# Altium schematic sheet 12V_9V_Power_Stage.SchDoc (part 2 of 4)
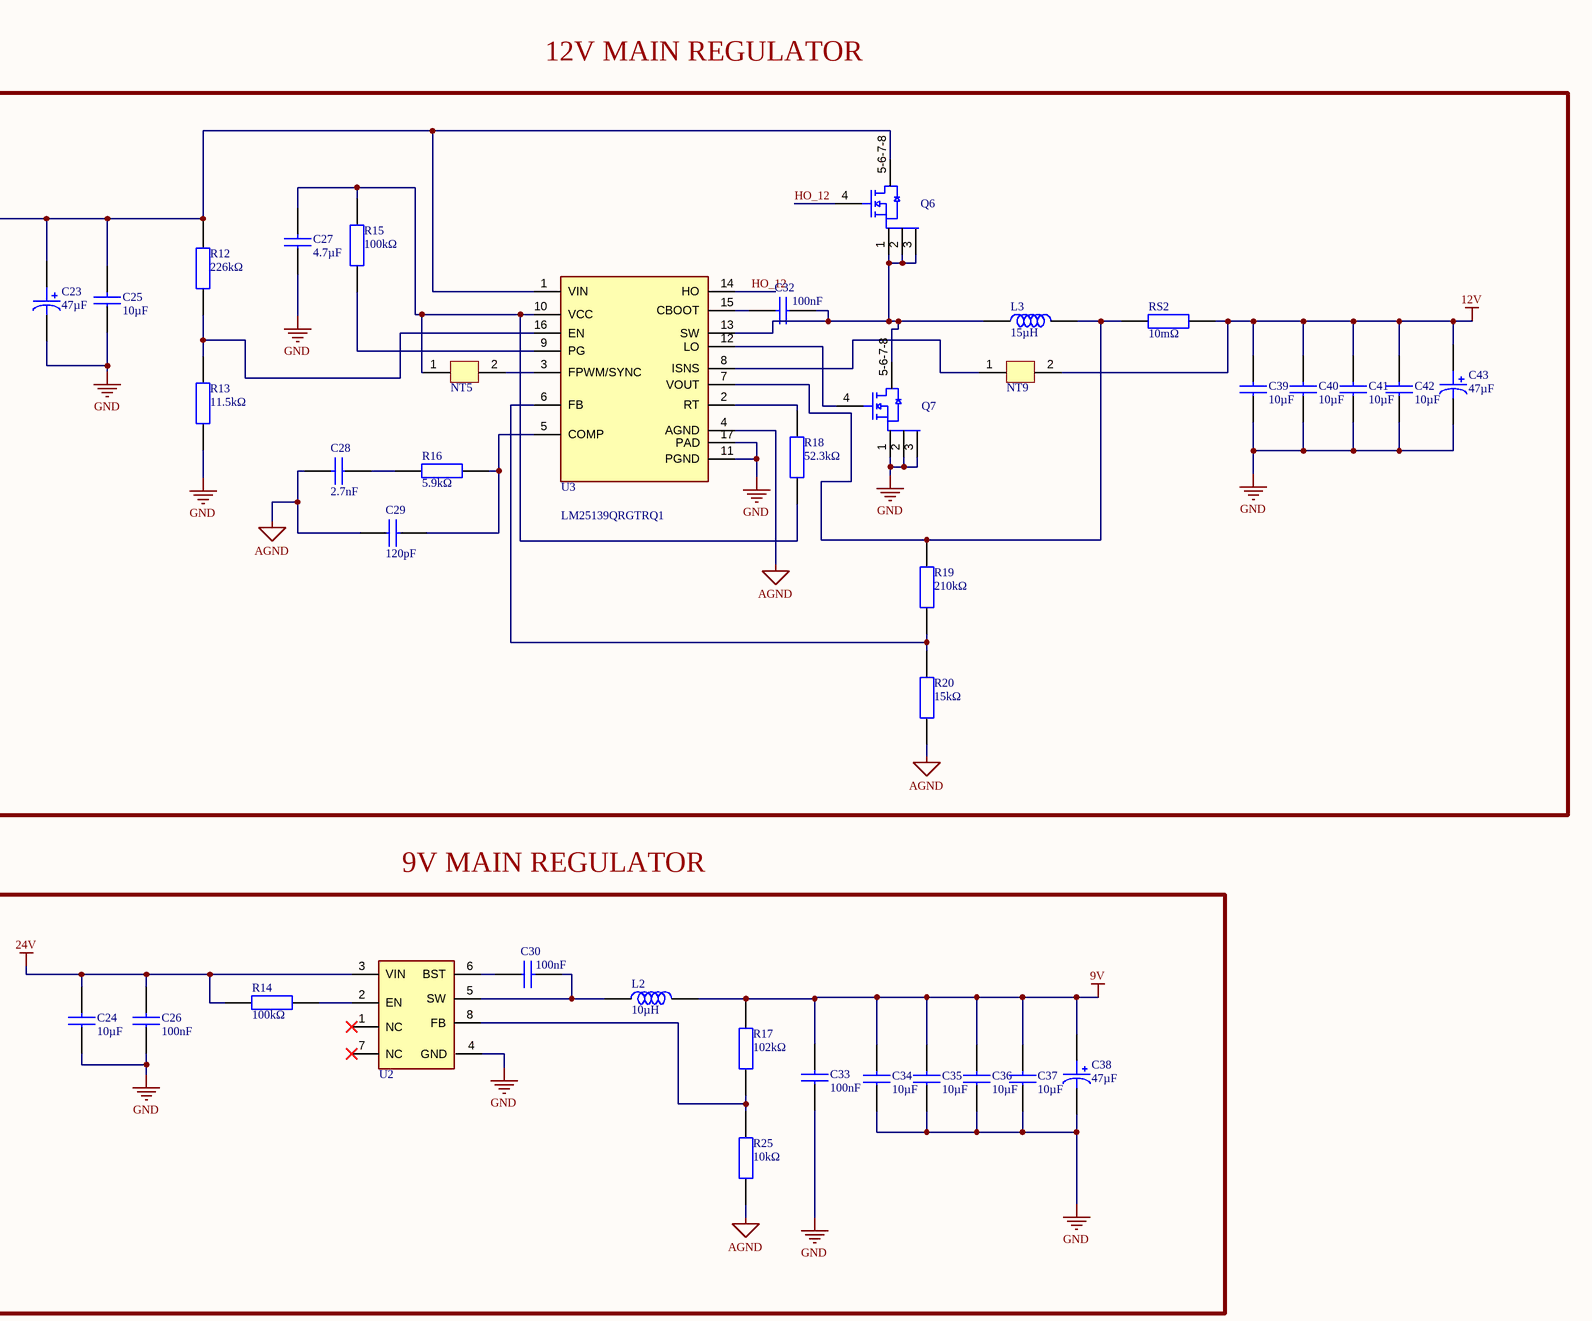
[diagram p2: 12V_9V_Power_Stage.SchDoc, right]

## Library data of the parts (continued)
C34-C37 C39-C42 = GRM31CR71E106KA12L: 25V 10uF X7R ±10% 1206 Multilayer Ceramic Capacitors MLCC - SMD/SMT ROHS; Manufacturer: Murata; Manufacturer Lifecycle Status: IN PRODUCTION; Supplier: Farnell; Supplier Part Number: GRM31CR71E106KA12L; Manufacturer Part Number: GRM31CR71E106KA12L; RoHS: Compliant; Category: Ceramic Capacitors; Stock: 33950; Pricing: 5=0,287, 50=0,122, 250=0,109, 500=0,085, 1000=0,0755 (EUR); Case/Package: 1206; Case Code (Imperial): 1206; Case Code (Metric): 3216; China RoHS: Compliant; Depth: 1.6mm; Dielectric: X7R; Dielectric Material: Ceramic; Height: 1.6mm; Lead Free: Lead Free; Length: 3.2mm; Lifecycle Status: Production; Material: Ceramic; Max Operating Temperature: 125°C; Min Operating Temperature: -55°C; Mounting Technology: Surface Mount; Pins: 2; Number of Terminals: 2; Packaging: Cut Tape; Radiation Hardening: No; REACH SVHC: Yes; Schedule B: 8532240020, 8532240020|8532240020, 8532240020|8532240020|8532240020, 8532240020|8532240020|8532240020|8532240020; Termination: SMD/SMT; Thickness: 1.6mm; Tolerance: 10%; Voltage: 25V; Voltage Rating: 25V; Voltage Rating (DC): 25V; Width: 1.6mm; ComponentLink1URL: https://datasheet.octopart.com:443/GRM31CR71E106KA12L-Murata-datasheet-32479577.pdf?src-supplier=Upverter; ComponentLink1Description: https://datasheet.octopart.com:443/GRM31CR71E106KA12L-Murata-datasheet-32479577.pdf?src-supplier=Upverter; ComponentLink2URL: https://datasheet.octopart.com:443/GRM31CR71E106KA12L-Murata-datasheet-62320264.pdf?src-supplier=Farnell; ComponentLink2Description: https://datasheet.octopart.com:443/GRM31CR71E106KA12L-Murata-datasheet-62320264.pdf?src-supplier=Farnell; ComponentLink3URL: https://datasheet.octopart.com:443/GRM31CR71E106KA12L-Murata-datasheet-7550257.pdf?src-supplier=Farnell; ComponentLink3Description: https://datasheet.octopart.com:443/GRM31CR71E106KA12L-Murata-datasheet-7550257.pdf?src-supplier=Farnell; ComponentLink4URL: https://datasheet.octopart.com:443/GRM31CR71E106KA12L-Murata-datasheet-8817987.pdf?src-supplier=Newark; ComponentLink4Description: https://datasheet.octopart.com:443/GRM31CR71E106KA12L-Murata-datasheet-8817987.pdf?src-supplier=Newark; ComponentLink5URL: https://datasheet.octopart.com:443/GRM31CR71E106KA12L-Murata-datasheet-8085059.pdf?src-supplier=element14+APAC; ComponentLink5Description: https://datasheet.octopart.com:443/GRM31CR71E106KA12L-Murata-datasheet-8085059.pdf?src-supplier=element14+APAC; ComponentLink6URL: https://datasheet.octopart.com:443/GRM31CR71E106KA12L-Murata-datasheet-17853182.pdf?src-supplier=element14+APAC; ComponentLink6Description: https://datasheet.octopart.com:443/GRM31CR71E106KA12L-Murata-datasheet-17853182.pdf?src-supplier=element14+APAC; ComponentLink7URL: https://datasheet.octopart.com:443/GRM31CR71E106KA12L-Murata-datasheet-14397761.pdf?src-supplier=Future+Electronics; ComponentLink7Description: https://datasheet.octopart.com:443/GRM31CR71E106KA12L-Murata-datasheet-14397761.pdf?src-supplier=Future+Electronics; ComponentLink8URL: https://datasheet.octopart.com:443/GRM31CR71E106KA12L-Murata-datasheet-22122223.pdf?src-supplier=Future+Electronics; ComponentLink8Description: https://datasheet.octopart.com:443/GRM31CR71E106KA12L-Murata-datasheet-22122223.pdf?src-supplier=Future+Electronics; ComponentLink9URL: https://datasheet.octopart.com:443/GRM31CR71E106KA12L-Murata-datasheet-12536416.pdf?src-supplier=Future+Electronics; ComponentLink9Description: https://datasheet.octopart.com:443/GRM31CR71E106KA12L-Murata-datasheet-12536416.pdf?src-supplier=Future+Electronics; ComponentLink10URL: https://datasheet.octopart.com:443/GRM31CR71E106KA12L-Murata-datasheet-38883574.pdf?src-supplier=Future+Electronics; ComponentLink10Description: https://datasheet.octopart.com:443/GRM31CR71E106KA12L-Murata-datasheet-38883574.pdf?src-supplier=Future+Electronics; ComponentLink11URL: https://datasheet.octopart.com:443/GRM31CR71E106KA12L-Murata-datasheet-165579666.pdf?src-supplier=TME; ComponentLink11Description: https://datasheet.octopart.com:443/GRM31CR71E106KA12L-Murata-datasheet-165579666.pdf?src-supplier=TME; ComponentLink12URL: https://datasheet.octopart.com:443/GRM31CR71E106KA12L-Murata-datasheet-59876780.pdf?src-supplier=TME; ComponentLink12Description: https://datasheet.octopart.com:443/GRM31CR71E106KA12L-Murata-datasheet-59876780.pdf?src-supplier=TME; ComponentLink13URL: https://datasheet.octopart.com:443/GRM31CR71E106KA12L-Murata-datasheet-140709144.pdf?src-supplier=Ciiva; ComponentLink13Description: https://datasheet.octopart.com:443/GRM31CR71E106KA12L-Murata-datasheet-140709144.pdf?src-supplier=Ciiva; ComponentLink14URL: https://datasheet.octopart.com:443/GRM31CR71E106KA12L-Murata-datasheet-138746391.pdf?src-supplier=Ciiva; ComponentLink14Description: https://datasheet.octopart.com:443/GRM31CR71E106KA12L-Murata-datasheet-138746391.pdf?src-supplier=Ciiva; ComponentLink15URL: https://datasheet.octopart.com:443/GRM31CR71E106KA12L-Murata-datasheet-102370999.pdf?src-supplier=HQonline; ComponentLink15Description: https://datasheet.octopart.com:443/GRM31CR71E106KA12L-Murata-datasheet-102370999.pdf?src-supplier=HQonline; ComponentLink16URL: https://datasheet.octopart.com/GRM31CR71E106KA12L-Murata-datasheet-12515295.pdf; ComponentLink16Description: https://datasheet.octopart.com/GRM31CR71E106KA12L-Murata-datasheet-12515295.pdf; ComponentLink17URL: https://datasheet.octopart.com/GRM31CR71E106KA12L-Murata-datasheet-12510076.pdf; ComponentLink17Description: https://datasheet.octopart.com/GRM31CR71E106KA12L-Murata-datasheet-12510076.pdf; ComponentLink18URL: https://datasheet.octopart.com/GRM31CR71E106KA12L-Murata-datasheet-11978611.pdf; ComponentLink18Description: https://datasheet.octopart.com/GRM31CR71E106KA12L-Murata-datasheet-11978611.pdf; ComponentLink19URL: https://datasheet.octopart.com/GRM31CR71E106KA12L-Murata-datasheet-10025737.pdf; ComponentLink19Description: https://datasheet.octopart.com/GRM31CR71E106KA12L-Murata-datasheet-10025737.pdf; ComponentLink20URL: https://datasheet.octopart.com/GRM31CR71E106KA12L-Murata-datasheet-8819587.pdf; ComponentLink20Description: https://datasheet.octopart.com/GRM31CR71E106KA12L-Murata-datasheet-8819587.pdf; ComponentLink21URL: https://datasheet.octopart.com:443/GRM31CR71E106KA12L-Murata-datasheet-151453090.pdf?src-supplier=Arrow.cn; ComponentLink21Description: https://datasheet.octopart.com:443/GRM31CR71E106KA12L-Murata-datasheet-151453090.pdf?src-supplier=Arrow.cn; ComponentLink22URL: http://sigma.octopart.com:80/reach_statement/Murata-company-16.pdf?src-supplier=Compliance+Statements; ComponentLink22Description: http://sigma.octopart.com:80/reach_statement/Murata-company-16.pdf?src-supplier=Compliance+Statements
L2 = SRR1208-100ML: Inductor Power Shielded Wirewound 10uH 20% 1KHz 20Q-Factor Ferrite 5A 0.021Ohm DCR T/R; Manufacturer: Bourns; DC Resistance (DCR): 21mΩ; Frequency: 15MHz; Material: Steel; Number of Circuits: 1; Q Factor: 20; Saturation Current: 6.7A; Supplier: Farnell; Supplier Part Number: SRR1208-100ML; Manufacturer Part Number: SRR1208-100ML; RoHS: Compliant; Category: Fixed Inductors; Stock: 4863; Pricing: 1=0,771, 10=0,653, 50=0,619, 100=0,551, 200=0,54 (EUR); Case/Package: 5050; China RoHS: Compliant; Composition: Wirewound; Core Material: Ferrite; Country of Origin: Mainland China; Current Rating: 5A; DC Current: 5A; Depth: 13mm; Export Control Classification Number (ECCN) Code: EAR99; Height: 8.5mm; Height - Seated (Max): 8.509mm; Harmonized Tariff Schedule (HTS) Code: 8504.50.80.00; Inductance Tolerance: 20%; Introduction Date: 2004-11-10; Length: 12.7mm; Lifecycle Status: Production; Max Current Rating: 5A; Max DC Current: 5A; Max Operating Temperature: 125°C; Military Standard: Not; Min Operating Temperature: -40°C; Mounting Technology: Surface Mount; Pins: 2; Number of Terminals: 2; REACH SVHC: Yes; Schedule B: 8504500000, 8504500000|8504500000, 8504500000|8504500000|8504500000, 8504500000|8504500000|8504500000|8504500000; Self Resonant Frequency: 15MHz; Shielding: Shielded; Termination: SMD/SMT; Test Frequency: 1kHz; Tolerance: 20%; Width: 12.7mm; ComponentLink1URL: https://datasheet.octopart.com:443/SRR1208-100ML-Bourns-datasheet-154729978.pdf?src-supplier=Newark; ComponentLink1Description: https://datasheet.octopart.com:443/SRR1208-100ML-Bourns-datasheet-154729978.pdf?src-supplier=Newark; ComponentLink2URL: https://datasheet.octopart.com:443/SRR1208-100ML-Bourns-datasheet-68307255.pdf?src-supplier=Newark; ComponentLink2Description: https://datasheet.octopart.com:443/SRR1208-100ML-Bourns-datasheet-68307255.pdf?src-supplier=Newark; ComponentLink3URL: https://datasheet.octopart.com:443/SRR1208-100ML-Bourns-datasheet-99355712.pdf?src-supplier=Newark; ComponentLink3Description: https://datasheet.octopart.com:443/SRR1208-100ML-Bourns-datasheet-99355712.pdf?src-supplier=Newark; ComponentLink4URL: https://datasheet.octopart.com:443/SRR1208-100ML-Bourns-datasheet-5459063.pdf?src-supplier=Newark; ComponentLink4Description: https://datasheet.octopart.com:443/SRR1208-100ML-Bourns-datasheet-5459063.pdf?src-supplier=Newark; ComponentLink5URL: https://datasheet.octopart.com:443/SRR1208-100ML-Bourns-datasheet-11548354.pdf?src-supplier=Farnell; ComponentLink5Description: https://datasheet.octopart.com:443/SRR1208-100ML-Bourns-datasheet-11548354.pdf?src-supplier=Farnell; ComponentLink6URL: https://datasheet.octopart.com:443/SRR1208-100ML-Bourns-datasheet-62333742.pdf?src-supplier=Farnell; ComponentLink6Description: https://datasheet.octopart.com:443/SRR1208-100ML-Bourns-datasheet-62333742.pdf?src-supplier=Farnell; ComponentLink7URL: https://datasheet.octopart.com:443/SRR1208-100ML-Bourns-datasheet-41338362.pdf?src-supplier=RS+(Formerly+Allied+Electronics); ComponentLink7Description: https://datasheet.octopart.com:443/SRR1208-100ML-Bourns-datasheet-41338362.pdf?src-supplier=RS+(Formerly+Allied+Electronics); ComponentLink8URL: https://datasheet.octopart.com:443/SRR1208-100ML-Bourns-datasheet-37486976.pdf?src-supplier=RS+(Formerly+Allied+Electronics); ComponentLink8Description: https://datasheet.octopart.com:443/SRR1208-100ML-Bourns-datasheet-37486976.pdf?src-supplier=RS+(Formerly+Allied+Electronics); ComponentLink9URL: https://datasheet.octopart.com:443/SRR1208-100ML-Bourns-datasheet-56155.pdf?src-supplier=RS+(Formerly+Allied+Electronics); ComponentLink9Description: https://datasheet.octopart.com:443/SRR1208-100ML-Bourns-datasheet-56155.pdf?src-supplier=RS+(Formerly+Allied+Electronics); ComponentLink10URL: http://sigma.octopart.com:80/conflict_mineral_statement/Bourns-company-36.pdf?src-supplier=Compliance+Statements; ComponentLink10Description: http://sigma.octopart.com:80/conflict_mineral_statement/Bourns-company-36.pdf?src-supplier=Compliance+Statements
L3 = MSS1210-153MED: General Purpose Inductor, 15uH, 20%, 1 Element, Ferrite-Core, SMD, 4848, CHIP, 4747; Manufacturer: Coilcraft; DC Resistance (DCR): 22mΩ; Max Current Rating: 5.7A; Max DC Current: 8.7A; Number of Circuits: 1; Saturation Current: 8.3A; Self Resonant Frequency: 12MHz; Shielding: Shielded; Test Frequency: 100kHz; Supplier: Farnell; Supplier Part Number: MSS1210-153MED; Manufacturer Part Number: MSS1210-153MED; RoHS: Compliant; Category: Fixed Inductors; Stock: 1322; Pricing: 1=4,65, 10=4,42, 25=4,19, 50=3,96, 100=3,11, 300=2,49 (EUR); Case/Package: SMD/SMT; Core Material: Ferrite; Height: 10mm; Inductance Tolerance: 20%; Lead Free: Contains Lead; Length: 12mm; Lifecycle Status: Production; Max Operating Temperature: 85°C; Min Operating Temperature: -40°C; Mounting Technology: Surface Mount; Number of Terminals: 2; Packaging: Cut Tape; Ratings: AEC-Q200; REACH SVHC: Yes; RMS Current (Irms): 8.7A; Termination: SMD/SMT; Tolerance: 20%; Width: 12mm; ComponentLink1URL: https://datasheet.octopart.com:443/MSS1210-153MED-Coilcraft-datasheet-180119303.pdf?src-supplier=IHS; ComponentLink1Description: https://datasheet.octopart.com:443/MSS1210-153MED-Coilcraft-datasheet-180119303.pdf?src-supplier=IHS; ComponentLink2URL: https://datasheet.octopart.com:443/MSS1210-153MED-Coilcraft-datasheet-14354322.pdf?src-supplier=Newark; ComponentLink2Description: https://datasheet.octopart.com:443/MSS1210-153MED-Coilcraft-datasheet-14354322.pdf?src-supplier=Newark; ComponentLink3URL: https://datasheet.octopart.com:443/MSS1210-153MED-Coilcraft-datasheet-17369939.pdf?src-supplier=Coilcraft+Direct; ComponentLink3Description: https://datasheet.octopart.com:443/MSS1210-153MED-Coilcraft-datasheet-17369939.pdf?src-supplier=Coilcraft+Direct
Q6 Q7 = CSD18540Q5B: 60-V, N channel NexFET™ power MOSFET, single SON 5 mm x 6 mm, 2.2 mOhm 8-VSON-CLIP -55 to 175; Manufacturer: Texas Instruments; Manufacturer Lifecycle Status: ACTIVE; Continuous Drain Current (ID): 29A; Drain to Source Resistance: 1.8mΩ; Drain to Source Voltage (Vdss): 60V; Fall Time: 3ns; Gate to Source Voltage (Vgs): 20V; Input Capacitance: 4.23nF; Max Junction Temperature (Tj): 175°C; Max Power Dissipation: 3.1W; Number of Channels: 1; Power Dissipation: 3.8W; Rds On Max: 2.2mΩ; Rise Time: 9ns; Turn-Off Delay Time: 20ns; Turn-On Delay Time: 6ns; Supplier: Arrow Electronics; Supplier Part Number: CSD18540Q5B; Manufacturer Part Number: CSD18540Q5B; RoHS: Compliant; Category: MOSFETs; Stock: 867; Pricing: 1=2,6866, 10=1,8382, 25=1,8215, 100=1,293, 250=1,2821, 500=1,0204 (USD); Contact Plating: Gold; Element Configuration: Single; Height: 0m; Lead Free: Contains Lead; Length: 5mm; Lifecycle Status: Production; Max Operating Temperature: 175°C; Min Operating Temperature: -55°C; Mounting Technology: Surface Mount; Pins: 8; Packaging: Tape & Reel (TR); Schedule B: 8541290080, 8541290080|8541290080|8541290080|8541290080|8541290080; Thickness: 950µm; Width: 5mm; ComponentLink1URL: https://datasheet.octopart.com:443/CSD18540Q5B-Texas-Instruments-datasheet-41215267.pdf?src-supplier=Texas+Instruments; ComponentLink1Description: https://datasheet.octopart.com:443/CSD18540Q5B-Texas-Instruments-datasheet-41215267.pdf?src-supplier=Texas+Instruments; ComponentLink2URL: https://octopart.com:443/opatz8j6/c1?t=SUskelIlBWIo_nWBJiAx1_ldGWU3oeiOn-EJs-5do1YusiS-JDvlKRrouVl-Y20ao-5z_08mEvz_AeJefeF_pOrLs0WfjhDJ2_xgnnOXWDpra4Cd3mKzckoQ6QanCMAXyB-vVCGNjBMeeyDAJ_8AtgWzG5J-VV0M2AC15IA14uOxBYYbIO1uRZi3YsibPr8OpLgj2-g8ey3MShCBBxtcPxAJXU9zClIpSD2jte82BFzbVJ9hhAzdJsrLZ3RNwxiUfmRI5v2vfH2Xq2tWnkVJNmbpw4R6VYt-2jb8TG9SzpqJvWz5ux_mibd2tkPbQSuE4I96mnLqjONPYMf24_myiaENOmBZXsZhO5Lu3rDJDhrEeNYScROBq6ZJRXBJXpuxfZxAZ_Uv9q79&src-supplier=Texas+Instruments; ComponentLink2Description: https://octopart.com:443/opatz8j6/c1?t=SUskelIlBWIo_nWBJiAx1_ldGWU3oeiOn-EJs-5do1YusiS-JDvlKRrouVl-Y20ao-5z_08mEvz_AeJefeF_pOrLs0WfjhDJ2_xgnnOXWDpra4Cd3mKzckoQ6QanCMAXyB-vVCGNjBMeeyDAJ_8AtgWzG5J-VV0M2AC15IA14uOxBYYbIO1uRZi3YsibPr8OpLgj2-g8ey3MShCBBxtcPxAJXU9zClIpSD2jte82BFzbVJ9hhAzdJsrLZ3RNwxiUfmRI5v2vfH2Xq2tWnkVJNmbpw4R6VYt-2jb8TG9SzpqJvWz5ux_mibd2tkPbQSuE4I96mnLqjONPYMf24_myiaENOmBZXsZhO5Lu3rDJDhrEeNYScROBq6ZJRXBJXpuxfZxAZ_Uv9q79&src-supplier=Texas+Instruments; ComponentLink3URL: https://datasheet.octopart.com:443/CSD18540Q5B-Texas-Instruments-datasheet-27303987.pdf?src-supplier=Texas+Instruments; ComponentLink3Description: https://datasheet.octopart.com:443/CSD18540Q5B-Texas-Instruments-datasheet-27303987.pdf?src-supplier=Texas+Instruments; ComponentLink4URL: https://datasheet.octopart.com:443/CSD18540Q5B-Texas-Instruments-datasheet-145028107.pdf?src-supplier=Arrow.cn; ComponentLink4Description: https://datasheet.octopart.com:443/CSD18540Q5B-Texas-Instruments-datasheet-145028107.pdf?src-supplier=Arrow.cn; ComponentLink5URL: http://sigma.octopart.com:80/reach_statement/Texas-Instruments-company-64.pdf?src-supplier=Compliance+Statements; ComponentLink5Description: http://sigma.octopart.com:80/reach_statement/Texas-Instruments-company-64.pdf?src-supplier=Compliance+Statements; ComponentLink6URL: http://sigma.octopart.com:80/conflict_mineral_statement/Texas-Instruments-company-63.pdf?src-supplier=Compliance+Statements; ComponentLink6Description: http://sigma.octopart.com:80/conflict_mineral_statement/Texas-Instruments-company-63.pdf?src-supplier=Compliance+Statements
R12 = CRCW0402226KFKED: Fixed Resistor, Metal Glaze/Thick Film, 0.063W, 226000ohm, 50V, 1% +/-Tol, Surface Mount, 0402; Manufacturer: Vishay; Max Power Dissipation: 63mW; Temperature Coefficient: 100ppm/°C; Supplier: Future Electronics; Supplier Part Number: CRCW0402226KFKED; Manufacturer Part Number: CRCW0402226KFKED; RoHS: Compliant; Category: Chip SMD Resistors; Stock: 20000; Pricing: 20000=0,0012, 100000=0,0011, 250000=0,0011, 750000=0,0011, 1500000=0,001 (USD); Case/Package: 0402; Case Code (Imperial): 0402; China RoHS: Non-Compliant; Composition: Thick Film; Contact Plating: Tin; Country of Origin: Israel, Taiwan; Depth: 500µm; Export Control Classification Number (ECCN) Code: EAR99; Features: Automotive AEC-Q200; Height: 350µm; Harmonized Tariff Schedule (HTS) Code: 8533.21.00.30; Introduction Date: 2005-03-24; Lead Free: Lead Free; Length: 1mm; Lifecycle Status: Production; Max Operating Temperature: 155°C; Military Standard: Not; Min Operating Temperature: -55°C; Mounting Technology: Surface Mount; Pins: 2; Number of Terminals: 2; Number of Terminations: 2; Packaging: Cut Tape; Power Rating: 63mW; Ratings: AEC-Q200; REACH SVHC: Yes; Termination: SMD/SMT; Tolerance: 1%; Voltage Rating: 50V; Voltage Rating (DC): 50V; Weight: 652.039032µg; Width: 500µm; Working Voltage: 50V; ComponentLink1URL: https://datasheet.octopart.com:443/CRCW0402226KFKED-Vishay-datasheet-175423584.pdf?src-supplier=IHS; ComponentLink1Description: https://datasheet.octopart.com:443/CRCW0402226KFKED-Vishay-datasheet-175423584.pdf?src-supplier=IHS; ComponentLink2URL: https://datasheet.octopart.com:443/CRCW0402226KFKED-Vishay-datasheet-66077789.pdf?src-supplier=Newark; ComponentLink2Description: https://datasheet.octopart.com:443/CRCW0402226KFKED-Vishay-datasheet-66077789.pdf?src-supplier=Newark; ComponentLink3URL: https://datasheet.octopart.com:443/CRCW0402226KFKED-Vishay-datasheet-11761042.pdf?src-supplier=Newark; ComponentLink3Description: https://datasheet.octopart.com:443/CRCW0402226KFKED-Vishay-datasheet-11761042.pdf?src-supplier=Newark; ComponentLink4URL: https://datasheet.octopart.com:443/CRCW0402226KFKED-Vishay-datasheet-11516975.pdf?src-supplier=Newark; ComponentLink4Description: https://datasheet.octopart.com:443/CRCW0402226KFKED-Vishay-datasheet-11516975.pdf?src-supplier=Newark; ComponentLink5URL: https://datasheet.octopart.com:443/CRCW0402226KFKED-Vishay-datasheet-159614168.pdf?src-supplier=Newark; ComponentLink5Description: https://datasheet.octopart.com:443/CRCW0402226KFKED-Vishay-datasheet-159614168.pdf?src-supplier=Newark; ComponentLink6URL: https://datasheet.octopart.com:443/CRCW0402226KFKED-Vishay-datasheet-33013972.pdf?src-supplier=Newark; ComponentLink6Description: https://datasheet.octopart.com:443/CRCW0402226KFKED-Vishay-datasheet-33013972.pdf?src-supplier=Newark; ComponentLink7URL: https://datasheet.octopart.com:443/CRCW0402226KFKED-Vishay-datasheet-21268114.pdf?src-supplier=Newark; ComponentLink7Description: https://datasheet.octopart.com:443/CRCW0402226KFKED-Vishay-datasheet-21268114.pdf?src-supplier=Newark; ComponentLink8URL: https://datasheet.octopart.com:443/CRCW0402226KFKED-Vishay-datasheet-21226360.pdf?src-supplier=Newark; ComponentLink8Description: https://datasheet.octopart.com:443/CRCW0402226KFKED-Vishay-datasheet-21226360.pdf?src-supplier=Newark; ComponentLink9URL: https://datasheet.octopart.com:443/CRCW0402226KFKED-Vishay-datasheet-62317933.pdf?src-supplier=element14+APAC; ComponentLink9Description: https://datasheet.octopart.com:443/CRCW0402226KFKED-Vishay-datasheet-62317933.pdf?src-supplier=element14+APAC; ComponentLink10URL: https://datasheet.octopart.com:443/CRCW0402226KFKED.-Vishay-datasheet-83961561.pdf?src-supplier=element14+APAC; ComponentLink10Description: https://datasheet.octopart.com:443/CRCW0402226KFKED.-Vishay-datasheet-83961561.pdf?src-supplier=element14+APAC; ComponentLink11URL: https://datasheet.octopart.com:443/CRCW0402226KFKED-Vishay-datasheet-14722531.pdf?src-supplier=element14+APAC; ComponentLink11Description: https://datasheet.octopart.com:443/CRCW0402226KFKED-Vishay-datasheet-14722531.pdf?src-supplier=element14+APAC; ComponentLink12URL: https://datasheet.octopart.com:443/CRCW0402226KFKED-Vishay-datasheet-5299586.pdf?src-supplier=element14+APAC; ComponentLink12Description: https://datasheet.octopart.com:443/CRCW0402226KFKED-Vishay-datasheet-5299586.pdf?src-supplier=element14+APAC; ComponentLink13URL: https://datasheet.octopart.com:443/CRCW0402226KFKED-Vishay-datasheet-10380026.pdf?src-supplier=element14+APAC; ComponentLink13Description: https://datasheet.octopart.com:443/CRCW0402226KFKED-Vishay-datasheet-10380026.pdf?src-supplier=element14+APAC; ComponentLink14URL: https://datasheet.octopart.com:443/CRCW0402226KFKED-Vishay-datasheet-62316122.pdf?src-supplier=Future+Electronics; ComponentLink14Description: https://datasheet.octopart.com:443/CRCW0402226KFKED-Vishay-datasheet-62316122.pdf?src-supplier=Future+Electronics; ComponentLink15URL: https://datasheet.octopart.com:443/CRCW0402226KFKED-Vishay-datasheet-12509741.pdf?src-supplier=Future+Electronics; ComponentLink15Description: https://datasheet.octopart.com:443/CRCW0402226KFKED-Vishay-datasheet-12509741.pdf?src-supplier=Future+Electronics; ComponentLink16URL: https://datasheet.octopart.com/D-CRCW-e3-Standard-Thick-Film-Chip-Resistors-Vishay-datasheet-family-64.pdf; ComponentLink16Description: https://datasheet.octopart.com/D-CRCW-e3-Standard-Thick-Film-Chip-Resistors-Vishay-datasheet-family-64.pdf; ComponentLink17URL: https://datasheet.octopart.com:443/CRCW0402226KFKED-Vishay-datasheet-8445837.pdf?src-supplier=element14; ComponentLink17Description: https://datasheet.octopart.com:443/CRCW0402226KFKED-Vishay-datasheet-8445837.pdf?src-supplier=element14; ComponentLink18URL: https://datasheet.octopart.com:443/CRCW0402226KFKED-Vishay-datasheet-5377255.pdf?src-supplier=Garrett; ComponentLink18Description: https://datasheet.octopart.com:443/CRCW0402226KFKED-Vishay-datasheet-5377255.pdf?src-supplier=Garrett; ComponentLink19URL: https://datasheet.octopart.com:443/CRCW0402226KFKED-Vishay-datasheet-148188.pdf?src-supplier=Garrett; ComponentLink19Description: https://datasheet.octopart.com:443/CRCW0402226KFKED-Vishay-datasheet-148188.pdf?src-supplier=Garrett; ComponentLink20URL: https://datasheet.octopart.com:443/CRCW0402226KFKED-Vishay-datasheet-42367.pdf?src-supplier=Garrett; ComponentLink20Description: https://datasheet.octopart.com:443/CRCW0402226KFKED-Vishay-datasheet-42367.pdf?src-supplier=Garrett; ComponentLink21URL: http://sigma.octopart.com:80/rohs_certificate/D-CRCW-e3-Standard-Thick-Film-Chip-Resistors-Vishay-family-102.pdf?src-supplier=Compliance+Statements; ComponentLink21Description: http://sigma.octopart.com:80/rohs_certificate/D-CRCW-e3-Standard-Thick-Film-Chip-Resistors-Vishay-family-102.pdf?src-supplier=Compliance+Statements
R13 = CRCW040211K5FKED: Res Thick Film 0402 11.5K Ohm 1% 1/16W ±100ppm/°C Molded SMD SMD Paper T/R; Manufacturer: Vishay; Max Power Dissipation: 63mW; Voltage Rating: 50V; Supplier: Farnell; Supplier Part Number: CRCW040211K5FKED; Manufacturer Part Number: CRCW040211K5FKED; RoHS: Compliant; Category: Chip SMD Resistors; Stock: 19624; Pricing: 10000=0,0092 (EUR); Case/Package: 0402; Case Code (Imperial): 0402; China RoHS: Non-Compliant; Composition: Thick Film; Contact Plating: Tin; Country of Origin: Israel, Taiwan; Depth: 500µm; Export Control Classification Number (ECCN) Code: EAR99; Features: Automotive AEC-Q200; Height: 350µm; Harmonized Tariff Schedule (HTS) Code: 8533.21.00.30; Introduction Date: 2005-03-24; Lead Free: Lead Free; Length: 1mm; Lifecycle Status: Production; Max Operating Temperature: 155°C; Military Standard: Not; Min Operating Temperature: -55°C; Mounting Technology: Surface Mount; Pins: 2; Number of Terminals: 2; Number of Terminations: 2; Packaging: Cut Tape; Power Rating: 63mW; Radiation Hardening: No; Ratings: AEC-Q200; REACH SVHC: Yes; Schedule B: 8533210045, 8533210045|8533210045, 8533210045|8533210045|8533210045, 8533210045|8533210045|8533210045|8533210045; Temperature Coefficient: 100ppm/°C; Termination: SMD/SMT; Tolerance: 1%; Voltage Rating (DC): 50V; Weight: 652.039032µg; Width: 500µm; Working Voltage: 50V; ComponentLink1URL: https://datasheet.octopart.com:443/CRCW040211K5FKED-Vishay-datasheet-175423584.pdf?src-supplier=IHS; ComponentLink1Description: https://datasheet.octopart.com:443/CRCW040211K5FKED-Vishay-datasheet-175423584.pdf?src-supplier=IHS; ComponentLink2URL: https://datasheet.octopart.com:443/CRCW040211K5FKED-Vishay-datasheet-66077789.pdf?src-supplier=Newark; ComponentLink2Description: https://datasheet.octopart.com:443/CRCW040211K5FKED-Vishay-datasheet-66077789.pdf?src-supplier=Newark; ComponentLink3URL: https://datasheet.octopart.com:443/CRCW040211K5FKED-Vishay-datasheet-11761042.pdf?src-supplier=Newark; ComponentLink3Description: https://datasheet.octopart.com:443/CRCW040211K5FKED-Vishay-datasheet-11761042.pdf?src-supplier=Newark; ComponentLink4URL: https://datasheet.octopart.com:443/CRCW040211K5FKED-Vishay-datasheet-21268114.pdf?src-supplier=Newark; ComponentLink4Description: https://datasheet.octopart.com:443/CRCW040211K5FKED-Vishay-datasheet-21268114.pdf?src-supplier=Newark; ComponentLink5URL: https://datasheet.octopart.com:443/CRCW040211K5FKED-Vishay-datasheet-21226360.pdf?src-supplier=Newark; ComponentLink5Description: https://datasheet.octopart.com:443/CRCW040211K5FKED-Vishay-datasheet-21226360.pdf?src-supplier=Newark; ComponentLink6URL: https://datasheet.octopart.com:443/CRCW040211K5FKED-Vishay-datasheet-62317936.pdf?src-supplier=Farnell; ComponentLink6Description: https://datasheet.octopart.com:443/CRCW040211K5FKED-Vishay-datasheet-62317936.pdf?src-supplier=Farnell; ComponentLink7URL: https://datasheet.octopart.com:443/CRCW040211K5FKED.-Vishay-datasheet-83961561.pdf?src-supplier=Farnell; ComponentLink7Description: https://datasheet.octopart.com:443/CRCW040211K5FKED.-Vishay-datasheet-83961561.pdf?src-supplier=Farnell; ComponentLink8URL: https://datasheet.octopart.com:443/CRCW040211K5FKED-Vishay-datasheet-11516975.pdf?src-supplier=Farnell; ComponentLink8Description: https://datasheet.octopart.com:443/CRCW040211K5FKED-Vishay-datasheet-11516975.pdf?src-supplier=Farnell; ComponentLink9URL: https://datasheet.octopart.com:443/CRCW040211K5FKED-Vishay-datasheet-33013972.pdf?src-supplier=element14+APAC; ComponentLink9Description: https://datasheet.octopart.com:443/CRCW040211K5FKED-Vishay-datasheet-33013972.pdf?src-supplier=element14+APAC; ComponentLink10URL: https://datasheet.octopart.com:443/CRCW040211K5FKED-Vishay-datasheet-14722531.pdf?src-supplier=element14+APAC; ComponentLink10Description: https://datasheet.octopart.com:443/CRCW040211K5FKED-Vishay-datasheet-14722531.pdf?src-supplier=element14+APAC; ComponentLink11URL: https://datasheet.octopart.com:443/CRCW040211K5FKED-Vishay-datasheet-137113230.pdf?src-supplier=X-ON; ComponentLink11Description: https://datasheet.octopart.com:443/CRCW040211K5FKED-Vishay-datasheet-137113230.pdf?src-supplier=X-ON; ComponentLink12URL: https://datasheet.octopart.com:443/CRCW040211K5FKED-Vishay-datasheet-62316122.pdf?src-supplier=Future+Electronics; ComponentLink12Description: https://datasheet.octopart.com:443/CRCW040211K5FKED-Vishay-datasheet-62316122.pdf?src-supplier=Future+Electronics; ComponentLink13URL: https://datasheet.octopart.com:443/CRCW040211K5FKED-Vishay-datasheet-12519820.pdf?src-supplier=Future+Electronics; ComponentLink13Description: https://datasheet.octopart.com:443/CRCW040211K5FKED-Vishay-datasheet-12519820.pdf?src-supplier=Future+Electronics; ComponentLink14URL: https://datasheet.octopart.com:443/CRCW040211K5FKED-Vishay-Dale-datasheet-47688880.pdf?src-supplier=RS+(Formerly+Allied+Electronics); ComponentLink14Description: https://datasheet.octopart.com:443/CRCW040211K5FKED-Vishay-Dale-datasheet-47688880.pdf?src-supplier=RS+(Formerly+Allied+Electronics); ComponentLink15URL: https://datasheet.octopart.com:443/CRCW040211K5FKED-Vishay-datasheet-12001583.pdf?src-supplier=RS+(Formerly+Allied+Electronics); ComponentLink15Description: https://datasheet.octopart.com:443/CRCW040211K5FKED-Vishay-datasheet-12001583.pdf?src-supplier=RS+(Formerly+Allied+Electronics); ComponentLink16URL: https://datasheet.octopart.com:443/CRCW040211K5FKED-Vishay-datasheet-5306405.pdf?src-supplier=RS+(Formerly+Allied+Electronics); ComponentLink16Description: https://datasheet.octopart.com:443/CRCW040211K5FKED-Vishay-datasheet-5306405.pdf?src-supplier=RS+(Formerly+Allied+Electronics); ComponentLink17URL: https://datasheet.octopart.com:443/CRCW040211K5FKED-Vishay-datasheet-11540273.pdf?src-supplier=Arrow+Electronics; ComponentLink17Description: https://datasheet.octopart.com:443/CRCW040211K5FKED-Vishay-datasheet-11540273.pdf?src-supplier=Arrow+Electronics; ComponentLink18URL: https://datasheet.octopart.com:443/CRCW040211K5FKED-Vishay-datasheet-8445837.pdf?src-supplier=element14; ComponentLink18Description: https://datasheet.octopart.com:443/CRCW040211K5FKED-Vishay-datasheet-8445837.pdf?src-supplier=element14; ComponentLink19URL: https://datasheet.octopart.com:443/CRCW040211K5FKED-Vishay-datasheet-5377255.pdf?src-supplier=Garrett; ComponentLink19Description: https://datasheet.octopart.com:443/CRCW040211K5FKED-Vishay-datasheet-5377255.pdf?src-supplier=Garrett; ComponentLink20URL: https://datasheet.octopart.com:443/CRCW040211K5FKED-Vishay-datasheet-148188.pdf?src-supplier=Garrett; ComponentLink20Description: https://datasheet.octopart.com:443/CRCW040211K5FKED-Vishay-datasheet-148188.pdf?src-supplier=Garrett; ComponentLink21URL: https://datasheet.octopart.com:443/CRCW040211K5FKED-Vishay-datasheet-42367.pdf?src-supplier=Garrett; ComponentLink21Description: https://datasheet.octopart.com:443/CRCW040211K5FKED-Vishay-datasheet-42367.pdf?src-supplier=Garrett; ComponentLink22URL: http://sigma.octopart.com:80/rohs_statement/Vishay-company-15.pdf?src-supplier=Compliance+Statements; ComponentLink22Description: http://sigma.octopart.com:80/rohs_statement/Vishay-company-15.pdf?src-supplier=Compliance+Statements
R14 R15 = CRCW0603100KFKEA: Res Thick Film 0603 100K Ohm 1% 1/3W ±100ppm/°C Molded SMD SMD Paper T/R; Manufacturer: Vishay; Manufacturer Part Number: CRCW0603100KFKEAHP; Max Power Dissipation: 250mW; Power Rating: 330mW; Voltage Rating: 75V; Supplier: Farnell; Supplier Part Number: CRCW0603100KFKEAHP; RoHS: Compliant; Category: Chip SMD Resistors; Stock: 78590; Pricing: 10=0,0404, 100=0,0303, 500=0,0261, 1000=0,0239, 2500=0,0223, 5000=0,0219 (EUR); Case/Package: 0603; Case Code (Imperial): 0603; Case Code (Metric): 1608; China RoHS: Non-Compliant; Composition: Thick Film; Contact Plating: Tin; Country of Origin: Israel; Depth: 850µm; Export Control Classification Number (ECCN) Code: EAR99; Features: Automotive AEC-Q200; Height: 450µm; Harmonized Tariff Schedule (HTS) Code: 8533.21.00.30; Introduction Date: 2008-07-29; Lead Free: Lead Free; Length: 1.6mm; Lifecycle Status: Production; Max Operating Temperature: 155°C; Military Standard: Not; Min Operating Temperature: -55°C; Mounting Technology: Surface Mount; Pins: 2; Number of Terminals: 2; Number of Terminations: 2; Packaging: Cut Tape; Radiation Hardening: No; Ratings: AEC-Q200; REACH SVHC: Yes; Schedule B: 8533210045, 8533210045|8533210045|8533210045|8533210045|8533210045; Temperature Coefficient: 100ppm/°C; Termination: SMD/SMT; Tolerance: 1%; Voltage Rating (DC): 75V; Weight: 2.012816mg; Width: 850µm; Working Voltage: 75V; ComponentLink1URL: https://datasheet.octopart.com:443/CRCW0603100KFKEAHP-Vishay-datasheet-13148866.pdf?src-supplier=Future+Electronics; ComponentLink1Description: https://datasheet.octopart.com:443/CRCW0603100KFKEAHP-Vishay-datasheet-13148866.pdf?src-supplier=Future+Electronics; ComponentLink2URL: https://datasheet.octopart.com:443/CRCW0603100KFKEAHP-Vishay-datasheet-13131392.pdf?src-supplier=Future+Electronics; ComponentLink2Description: https://datasheet.octopart.com:443/CRCW0603100KFKEAHP-Vishay-datasheet-13131392.pdf?src-supplier=Future+Electronics; ComponentLink3URL: https://datasheet.octopart.com:443/CRCW0603100KFKEAHP-Vishay-datasheet-12593106.pdf?src-supplier=Future+Electronics; ComponentLink3Description: https://datasheet.octopart.com:443/CRCW0603100KFKEAHP-Vishay-datasheet-12593106.pdf?src-supplier=Future+Electronics; ComponentLink4URL: https://datasheet.octopart.com:443/CRCW0603100KFKEAHP-Vishay-datasheet-12531795.pdf?src-supplier=Future+Electronics; ComponentLink4Description: https://datasheet.octopart.com:443/CRCW0603100KFKEAHP-Vishay-datasheet-12531795.pdf?src-supplier=Future+Electronics; ComponentLink5URL: https://datasheet.octopart.com:443/CRCW0603100KFKEAHP-Vishay-datasheet-12518686.pdf?src-supplier=Future+Electronics; ComponentLink5Description: https://datasheet.octopart.com:443/CRCW0603100KFKEAHP-Vishay-datasheet-12518686.pdf?src-supplier=Future+Electronics; ComponentLink6URL: https://datasheet.octopart.com:443/CRCW0603100KFKEAHP-Vishay-datasheet-12509906.pdf?src-supplier=Future+Electronics; ComponentLink6Description: https://datasheet.octopart.com:443/CRCW0603100KFKEAHP-Vishay-datasheet-12509906.pdf?src-supplier=Future+Electronics; ComponentLink7URL: https://datasheet.octopart.com:443/CRCW0603100KFKEAHP-Vishay-datasheet-10669844.pdf?src-supplier=Future+Electronics; ComponentLink7Description: https://datasheet.octopart.com:443/CRCW0603100KFKEAHP-Vishay-datasheet-10669844.pdf?src-supplier=Future+Electronics; ComponentLink8URL: https://datasheet.octopart.com:443/CRCW0603100KFKEAHP-Vishay-datasheet-8703221.pdf?src-supplier=Future+Electronics; ComponentLink8Description: https://datasheet.octopart.com:443/CRCW0603100KFKEAHP-Vishay-datasheet-8703221.pdf?src-supplier=Future+Electronics; ComponentLink9URL: https://datasheet.octopart.com:443/CRCW0603100KFKEAHP-Vishay-datasheet-62316122.pdf?src-supplier=Future+Electronics; ComponentLink9Description: https://datasheet.octopart.com:443/CRCW0603100KFKEAHP-Vishay-datasheet-62316122.pdf?src-supplier=Future+Electronics; ComponentLink10URL: https://datasheet.octopart.com:443/CRCW0603100KFKEAHP-Vishay-datasheet-12544674.pdf?src-supplier=_legacy+Avnet; ComponentLink10Description: https://datasheet.octopart.com:443/CRCW0603100KFKEAHP-Vishay-datasheet-12544674.pdf?src-supplier=_legacy+Avnet; ComponentLink11URL: https://datasheet.octopart.com:443/CRCW0603100KFKEAHP-Vishay-datasheet-87136057.pdf?src-supplier=Newark; ComponentLink11Description: https://datasheet.octopart.com:443/CRCW0603100KFKEAHP-Vishay-datasheet-87136057.pdf?src-supplier=Newark; ComponentLink12URL: https://datasheet.octopart.com:443/CRCW0603100KFKEAHP-Vishay-datasheet-66581887.pdf?src-supplier=Newark; ComponentLink12Description: https://datasheet.octopart.com:443/CRCW0603100KFKEAHP-Vishay-datasheet-66581887.pdf?src-supplier=Newark; ComponentLink13URL: https://datasheet.octopart.com:443/CRCW0603100KFKEAHP-Vishay-datasheet-37143532.pdf?src-supplier=Newark; ComponentLink13Description: https://datasheet.octopart.com:443/CRCW0603100KFKEAHP-Vishay-datasheet-37143532.pdf?src-supplier=Newark; ComponentLink14URL: https://datasheet.octopart.com:443/CRCW0603100KFKEAHP-Vishay-datasheet-8359436.pdf?src-supplier=Newark; ComponentLink14Description: https://datasheet.octopart.com:443/CRCW0603100KFKEAHP-Vishay-datasheet-8359436.pdf?src-supplier=Newark; ComponentLink15URL: https://datasheet.octopart.com:443/CRCW0603100KFKEAHP-Vishay-datasheet-112276998.pdf?src-supplier=Newark; ComponentLink15Description: https://datasheet.octopart.com:443/CRCW0603100KFKEAHP-Vishay-datasheet-112276998.pdf?src-supplier=Newark; ComponentLink16URL: https://datasheet.octopart.com:443/CRCW0603100KFKEAHP-Vishay-datasheet-62317933.pdf?src-supplier=element14+APAC; ComponentLink16Description: https://datasheet.octopart.com:443/CRCW0603100KFKEAHP-Vishay-datasheet-62317933.pdf?src-supplier=element14+APAC; ComponentLink17URL: https://datasheet.octopart.com/CRCW0603100KFKEAHP-Vishay-datasheet-83567917.pdf; ComponentLink17Description: https://datasheet.octopart.com/CRCW0603100KFKEAHP-Vishay-datasheet-83567917.pdf; ComponentLink18URL: https://datasheet.octopart.com/D-CRCW-e3-Standard-Thick-Film-Chip-Resistors-Vishay-datasheet-family-64.pdf; ComponentLink18Description: https://datasheet.octopart.com/D-CRCW-e3-Standard-Thick-Film-Chip-Resistors-Vishay-datasheet-family-64.pdf; ComponentLink19URL: https://datasheet.octopart.com:443/CRCW0603100KFKEAHP-Vishay-Dale-datasheet-47688881.pdf?src-supplier=RS+(Formerly+Allied+Electronics); ComponentLink19Description: https://datasheet.octopart.com:443/CRCW0603100KFKEAHP-Vishay-Dale-datasheet-47688881.pdf?src-supplier=RS+(Formerly+Allied+Electronics); ComponentLink20URL: http://sigma.octopart.com:80/rohs_certificate/D-CRCW-e3-Standard-Thick-Film-Chip-Resistors-Vishay-family-102.pdf?src-supplier=Compliance+Statements; ComponentLink20Description: http://sigma.octopart.com:80/rohs_certificate/D-CRCW-e3-Standard-Thick-Film-Chip-Resistors-Vishay-family-102.pdf?src-supplier=Compliance+Statements
R16 = CRCW04025K90FKED: Res Thick Film 0402 5.9K Ohm 1% 1/16W ±100ppm/°C Molded SMD Paper T/R; Manufacturer: Vishay; Max Power Dissipation: 63mW; Voltage Rating: 50V; Supplier: Farnell; Supplier Part Number: CRCW04025K90FKED; Manufacturer Part Number: CRCW04025K90FKED; RoHS: Compliant; Category: Chip SMD Resistors; Stock: 3452; Pricing: 10=0,02, 100=0,0145, 500=0,0117, 2500=0,0097, 5000=0,0095 (EUR); Case/Package: 0402; Case Code (Imperial): 0402; China RoHS: Non-Compliant; Composition: Thick Film; Contact Plating: Tin; Country of Origin: Israel, Taiwan; Depth: 500µm; Export Control Classification Number (ECCN) Code: EAR99; Features: Automotive AEC-Q200; Height: 350µm; Harmonized Tariff Schedule (HTS) Code: 8533.21.00.30; Introduction Date: 2005-03-24; Lead Free: Lead Free; Length: 1mm; Lifecycle Status: Production; Max Operating Temperature: 155°C; Military Standard: Not; Min Operating Temperature: -55°C; Mounting Technology: Surface Mount; Pins: 2; Number of Terminals: 2; Number of Terminations: 2; Packaging: Cut Tape; Power Rating: 63mW; Radiation Hardening: No; Ratings: AEC-Q200; REACH SVHC: Yes; Schedule B: 8533210045; Temperature Coefficient: 100ppm/°C; Termination: SMD/SMT; Tolerance: 1%; Voltage Rating (DC): 50V; Weight: 652.039032µg; Width: 500µm; Working Voltage: 50V; ComponentLink1URL: https://datasheet.octopart.com:443/CRCW04025K90FKED-Vishay-datasheet-175423584.pdf?src-supplier=IHS; ComponentLink1Description: https://datasheet.octopart.com:443/CRCW04025K90FKED-Vishay-datasheet-175423584.pdf?src-supplier=IHS; ComponentLink2URL: https://datasheet.octopart.com:443/CRCW04025K90FKED-Vishay-datasheet-190005712.pdf?src-supplier=TME; ComponentLink2Description: https://datasheet.octopart.com:443/CRCW04025K90FKED-Vishay-datasheet-190005712.pdf?src-supplier=TME; ComponentLink3URL: https://datasheet.octopart.com:443/CRCW04025K90FKED-Vishay-datasheet-66077789.pdf?src-supplier=Newark; ComponentLink3Description: https://datasheet.octopart.com:443/CRCW04025K90FKED-Vishay-datasheet-66077789.pdf?src-supplier=Newark; ComponentLink4URL: https://datasheet.octopart.com:443/CRCW04025K90FKED-Vishay-datasheet-11761042.pdf?src-supplier=Newark; ComponentLink4Description: https://datasheet.octopart.com:443/CRCW04025K90FKED-Vishay-datasheet-11761042.pdf?src-supplier=Newark; ComponentLink5URL: https://datasheet.octopart.com:443/CRCW04025K90FKED-Vishay-datasheet-41302739.pdf?src-supplier=Newark; ComponentLink5Description: https://datasheet.octopart.com:443/CRCW04025K90FKED-Vishay-datasheet-41302739.pdf?src-supplier=Newark; ComponentLink6URL: https://datasheet.octopart.com:443/CRCW04025K90FKED-Vishay-datasheet-33013972.pdf?src-supplier=Newark; ComponentLink6Description: https://datasheet.octopart.com:443/CRCW04025K90FKED-Vishay-datasheet-33013972.pdf?src-supplier=Newark; ComponentLink7URL: https://datasheet.octopart.com:443/CRCW04025K90FKED-Vishay-datasheet-21226360.pdf?src-supplier=Newark; ComponentLink7Description: https://datasheet.octopart.com:443/CRCW04025K90FKED-Vishay-datasheet-21226360.pdf?src-supplier=Newark; ComponentLink8URL: https://datasheet.octopart.com:443/CRCW04025K90FKED-Vishay-datasheet-62317933.pdf?src-supplier=Farnell; ComponentLink8Description: https://datasheet.octopart.com:443/CRCW04025K90FKED-Vishay-datasheet-62317933.pdf?src-supplier=Farnell; ComponentLink9URL: https://datasheet.octopart.com:443/CRCW04025K90FKED.-Vishay-datasheet-83961561.pdf?src-supplier=Farnell; ComponentLink9Description: https://datasheet.octopart.com:443/CRCW04025K90FKED.-Vishay-datasheet-83961561.pdf?src-supplier=Farnell; ComponentLink10URL: https://datasheet.octopart.com:443/CRCW04025K90FKED-Vishay-datasheet-11516975.pdf?src-supplier=Farnell; ComponentLink10Description: https://datasheet.octopart.com:443/CRCW04025K90FKED-Vishay-datasheet-11516975.pdf?src-supplier=Farnell; ComponentLink11URL: https://datasheet.octopart.com:443/CRCW04025K90FKED-Vishay-datasheet-14722531.pdf?src-supplier=element14+APAC; ComponentLink11Description: https://datasheet.octopart.com:443/CRCW04025K90FKED-Vishay-datasheet-14722531.pdf?src-supplier=element14+APAC; ComponentLink12URL: https://datasheet.octopart.com:443/CRCW04025K90FKED-Vishay-datasheet-5299586.pdf?src-supplier=element14+APAC; ComponentLink12Description: https://datasheet.octopart.com:443/CRCW04025K90FKED-Vishay-datasheet-5299586.pdf?src-supplier=element14+APAC; ComponentLink13URL: https://datasheet.octopart.com:443/CRCW04025K90FKED-Vishay-datasheet-10380026.pdf?src-supplier=element14+APAC; ComponentLink13Description: https://datasheet.octopart.com:443/CRCW04025K90FKED-Vishay-datasheet-10380026.pdf?src-supplier=element14+APAC; ComponentLink14URL: https://datasheet.octopart.com:443/CRCW04025K90FKED-Vishay-datasheet-62316122.pdf?src-supplier=Future+Electronics; ComponentLink14Description: https://datasheet.octopart.com:443/CRCW04025K90FKED-Vishay-datasheet-62316122.pdf?src-supplier=Future+Electronics; ComponentLink15URL: https://datasheet.octopart.com:443/CRCW04025K90FKED-Vishay-datasheet-12519820.pdf?src-supplier=Future+Electronics; ComponentLink15Description: https://datasheet.octopart.com:443/CRCW04025K90FKED-Vishay-datasheet-12519820.pdf?src-supplier=Future+Electronics; ComponentLink16URL: https://datasheet.octopart.com:443/CRCW04025K90FKED-Vishay-Dale-datasheet-47688880.pdf?src-supplier=RS+(Formerly+Allied+Electronics); ComponentLink16Description: https://datasheet.octopart.com:443/CRCW04025K90FKED-Vishay-Dale-datasheet-47688880.pdf?src-supplier=RS+(Formerly+Allied+Electronics); ComponentLink17URL: https://datasheet.octopart.com:443/CRCW04025K90FKED-Vishay-datasheet-12001583.pdf?src-supplier=RS+(Formerly+Allied+Electronics); ComponentLink17Description: https://datasheet.octopart.com:443/CRCW04025K90FKED-Vishay-datasheet-12001583.pdf?src-supplier=RS+(Formerly+Allied+Electronics); ComponentLink18URL: https://datasheet.octopart.com:443/CRCW04025K90FKED-Vishay-datasheet-5306405.pdf?src-supplier=RS+(Formerly+Allied+Electronics); ComponentLink18Description: https://datasheet.octopart.com:443/CRCW04025K90FKED-Vishay-datasheet-5306405.pdf?src-supplier=RS+(Formerly+Allied+Electronics); ComponentLink19URL: https://datasheet.octopart.com/D-CRCW-e3-Standard-Thick-Film-Chip-Resistors-Vishay-datasheet-family-64.pdf; ComponentLink19Description: https://datasheet.octopart.com/D-CRCW-e3-Standard-Thick-Film-Chip-Resistors-Vishay-datasheet-family-64.pdf; ComponentLink20URL: https://datasheet.octopart.com:443/CRCW04025K90FKED-Vishay-datasheet-8445837.pdf?src-supplier=element14; ComponentLink20Description: https://datasheet.octopart.com:443/CRCW04025K90FKED-Vishay-datasheet-8445837.pdf?src-supplier=element14; ComponentLink21URL: https://datasheet.octopart.com:443/CRCW04025K90FKED-Vishay-datasheet-5377255.pdf?src-supplier=Garrett; ComponentLink21Description: https://datasheet.octopart.com:443/CRCW04025K90FKED-Vishay-datasheet-5377255.pdf?src-supplier=Garrett; ComponentLink22URL: https://datasheet.octopart.com:443/CRCW04025K90FKED-Vishay-datasheet-148188.pdf?src-supplier=Garrett; ComponentLink22Description: https://datasheet.octopart.com:443/CRCW04025K90FKED-Vishay-datasheet-148188.pdf?src-supplier=Garrett; ComponentLink23URL: https://datasheet.octopart.com:443/CRCW04025K90FKED-Vishay-datasheet-42367.pdf?src-supplier=Garrett; ComponentLink23Description: https://datasheet.octopart.com:443/CRCW04025K90FKED-Vishay-datasheet-42367.pdf?src-supplier=Garrett; ComponentLink24URL: http://sigma.octopart.com:80/rohs_certificate/D-CRCW-e3-Standard-Thick-Film-Chip-Resistors-Vishay-family-102.pdf?src-supplier=Compliance+Statements; ComponentLink24Description: http://sigma.octopart.com:80/rohs_certificate/D-CRCW-e3-Standard-Thick-Film-Chip-Resistors-Vishay-family-102.pdf?src-supplier=Compliance+Statements